# Altium schematic sheet OSCILLAR_HFB_V1p0_AFILT.SchDoc
size A4; SheetNumber: 13; SheetTotal: 17; Title_: Filter assemly
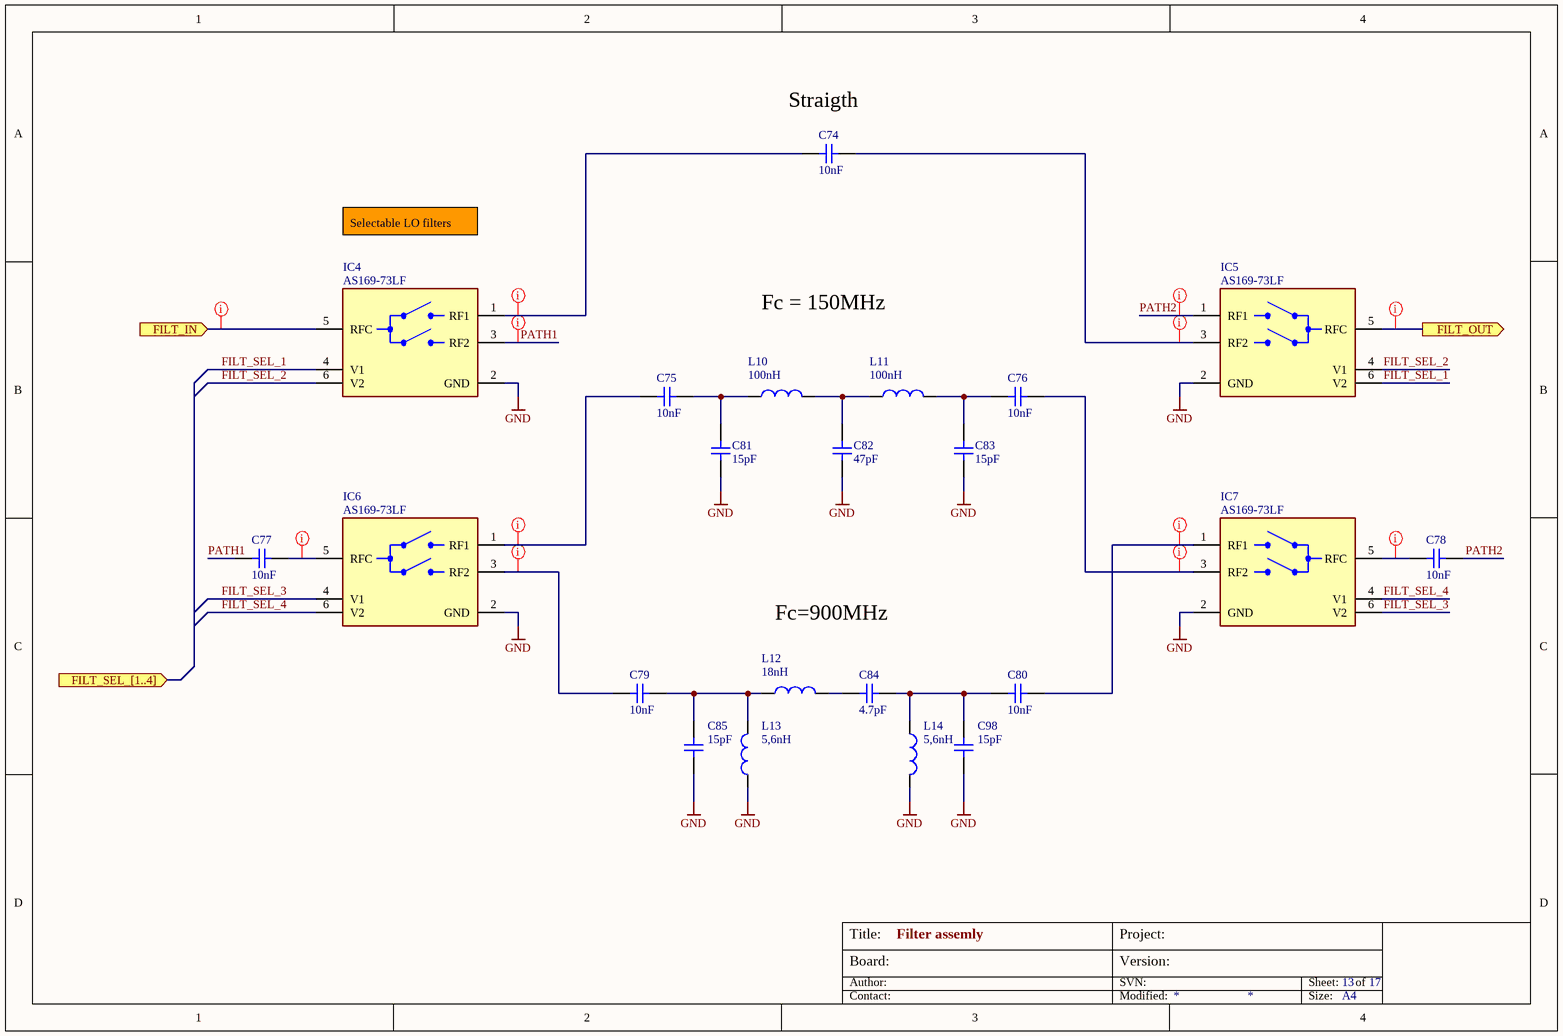
[diagram p0: OSCILLAR_HFB_V1p0_AFILT.SchDoc]

## Parts
C74  10nF  [CAP_0603]
C75  10nF  [CAP_0603]
C76  10nF  [CAP_0603]
C77  10nF  [CAP_0603]
C78  10nF  [CAP_0603]
C79  10nF  [CAP_0603]
C80  10nF  [CAP_0603]
C81  15pF  [CAP_0603]
C82  47pF  [CAP_0603]
C83  15pF  [CAP_0603]
C84  4.7pF  [CAP_0603]
C85  15pF  [CAP_0603]
C98  15pF  [CAP_0603]
IC4  AS169-73LF  [SOT-23-6]
IC5  AS169-73LF  [SOT-23-6]
IC6  AS169-73LF  [SOT-23-6]
IC7  AS169-73LF  [SOT-23-6]
L10  100nH  [IND-0805]
L11  100nH  [IND-0805]
L12  18nH  [IND-0805]
L13  5,6nH  [IND-0805]
L14  5,6nH  [IND-0805]

## Ports
FILT_IN (in, see PASRAD_CU_V1p0_DCLK[2C]), FILT_OUT (out, see PASRAD_CU_V1p0_DCLK[3C]), FILT_SEL_[1..4] (in, see PASRAD_CU_V1p0_DCLK[2C])

## Nets
GND: C81.1 C82.1 C83.1 C85.2 C98.2 IC4.2(GND) IC5.2(GND) IC6.2(GND) IC7.2(GND) L13.1 L14.1
FILT_IN: IC4.5(RFC) ; port FILT_IN
FILT_OUT: IC5.5(RFC) ; port FILT_OUT
FILT_SEL_1: IC4.4(V1) IC5.6(V2)
FILT_SEL_2: IC4.6(V2) IC5.4(V1)
FILT_SEL_3: IC6.4(V1) IC7.6(V2)
FILT_SEL_4: IC6.6(V2) IC7.4(V1)
PATH1: C77.2 IC4.3(RF2)
PATH2: C78.1 IC5.1(RF1)
NetC74_1: C74.1 IC5.3(RF2)
NetC74_2: C74.2 IC4.1(RF1)
NetC75_1: C75.1 C81.2 L10.1
NetC75_2: C75.2 IC6.1(RF1)
NetC76_1: C76.1 IC7.3(RF2)
NetC76_2: C76.2 C83.2 L11.2
NetC77_1: C77.1 IC6.5(RFC)
NetC78_2: C78.2 IC7.5(RFC)
NetC79_1: C79.1 C85.1 L12.1 L13.2
NetC79_2: C79.2 IC6.3(RF2)
NetC80_1: C80.1 IC7.1(RF1)
NetC80_2: C80.2 C84.1 C98.1 L14.2
NetC82_2: C82.2 L10.2 L11.1
NetC84_2: C84.2 L12.2

## Layout directives
net class 50R: FILT_IN, FILT_OUT, NetC74_1, NetC74_2, NetC75_2, NetC76_1, NetC77_1, NetC78_2, NetC79_2, NetC80_1, PATH1, PATH2

## Notes on the sheet
- (near C74) Straigth
- Selectable LO filters
- Fc = 150MHz
- Fc=900MHz
- Board:
- Author:
- Title:
- Project:
- SVN:
- Version:
- Sheet:
- of
- Contact:
- Modified:
- Size:
- A4

## Library data of the parts
C74-C85 C98 = NP-CAPACITOR: MLCC capacitor; Type: CAP
IC4-IC7 = AS169-73LF: RF Switch, SPDT, 300k-2.5GHz; Part number: 873-AS169-73LF; Supplier: Mouser; Type: IC; ComponentLink1Description: Datasheet; ComponentLink1URL: AS169_200105E-3365381; ComponentLink2Description: Order; ComponentLink2URL: https://eu.mouser.com/ProductDetail/Skyworks-Solutions-Inc/AS169-73LF?qs=WMHGlxXAKT9QQcX4VtVmzg%3D%3D
L10 L11 = AC-INDUCTOR: IMC0805ERR10J01; Type: IND
L12 = AC-INDUCTOR: IMC0805ER18NJ01; Type: IND
L13 L14 = AC-INDUCTOR: IMC0805ER5N6J01; Type: IND